# EAGLE schematic Lora_LR1262_Node_ Board_V1.0(1) (EAGLE 9.5.1)
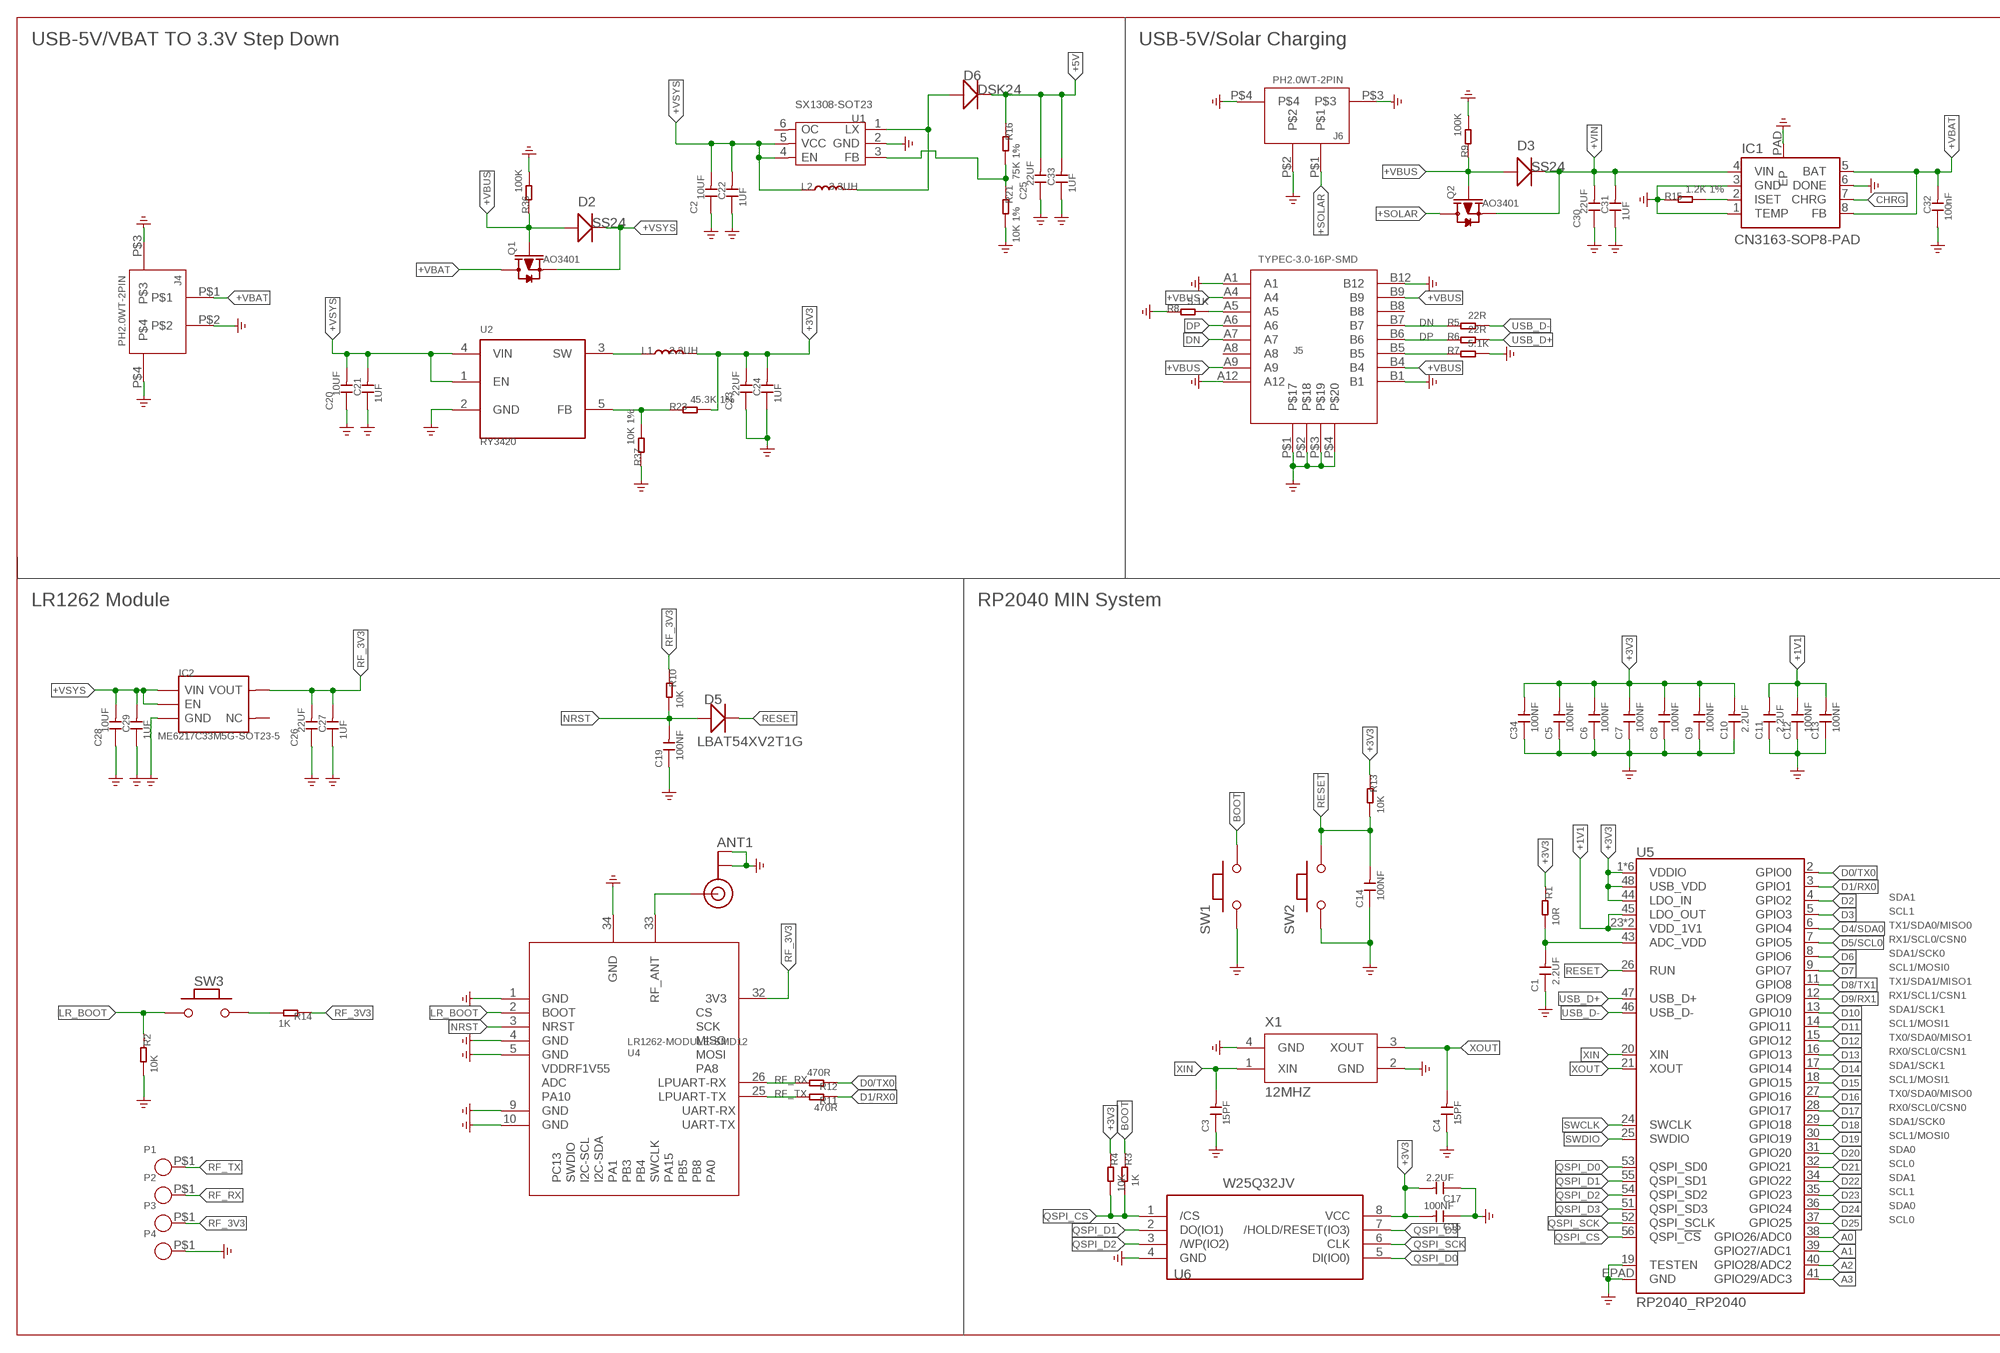
[diagram p0: schematic, sheet 1, part 1 of 2]
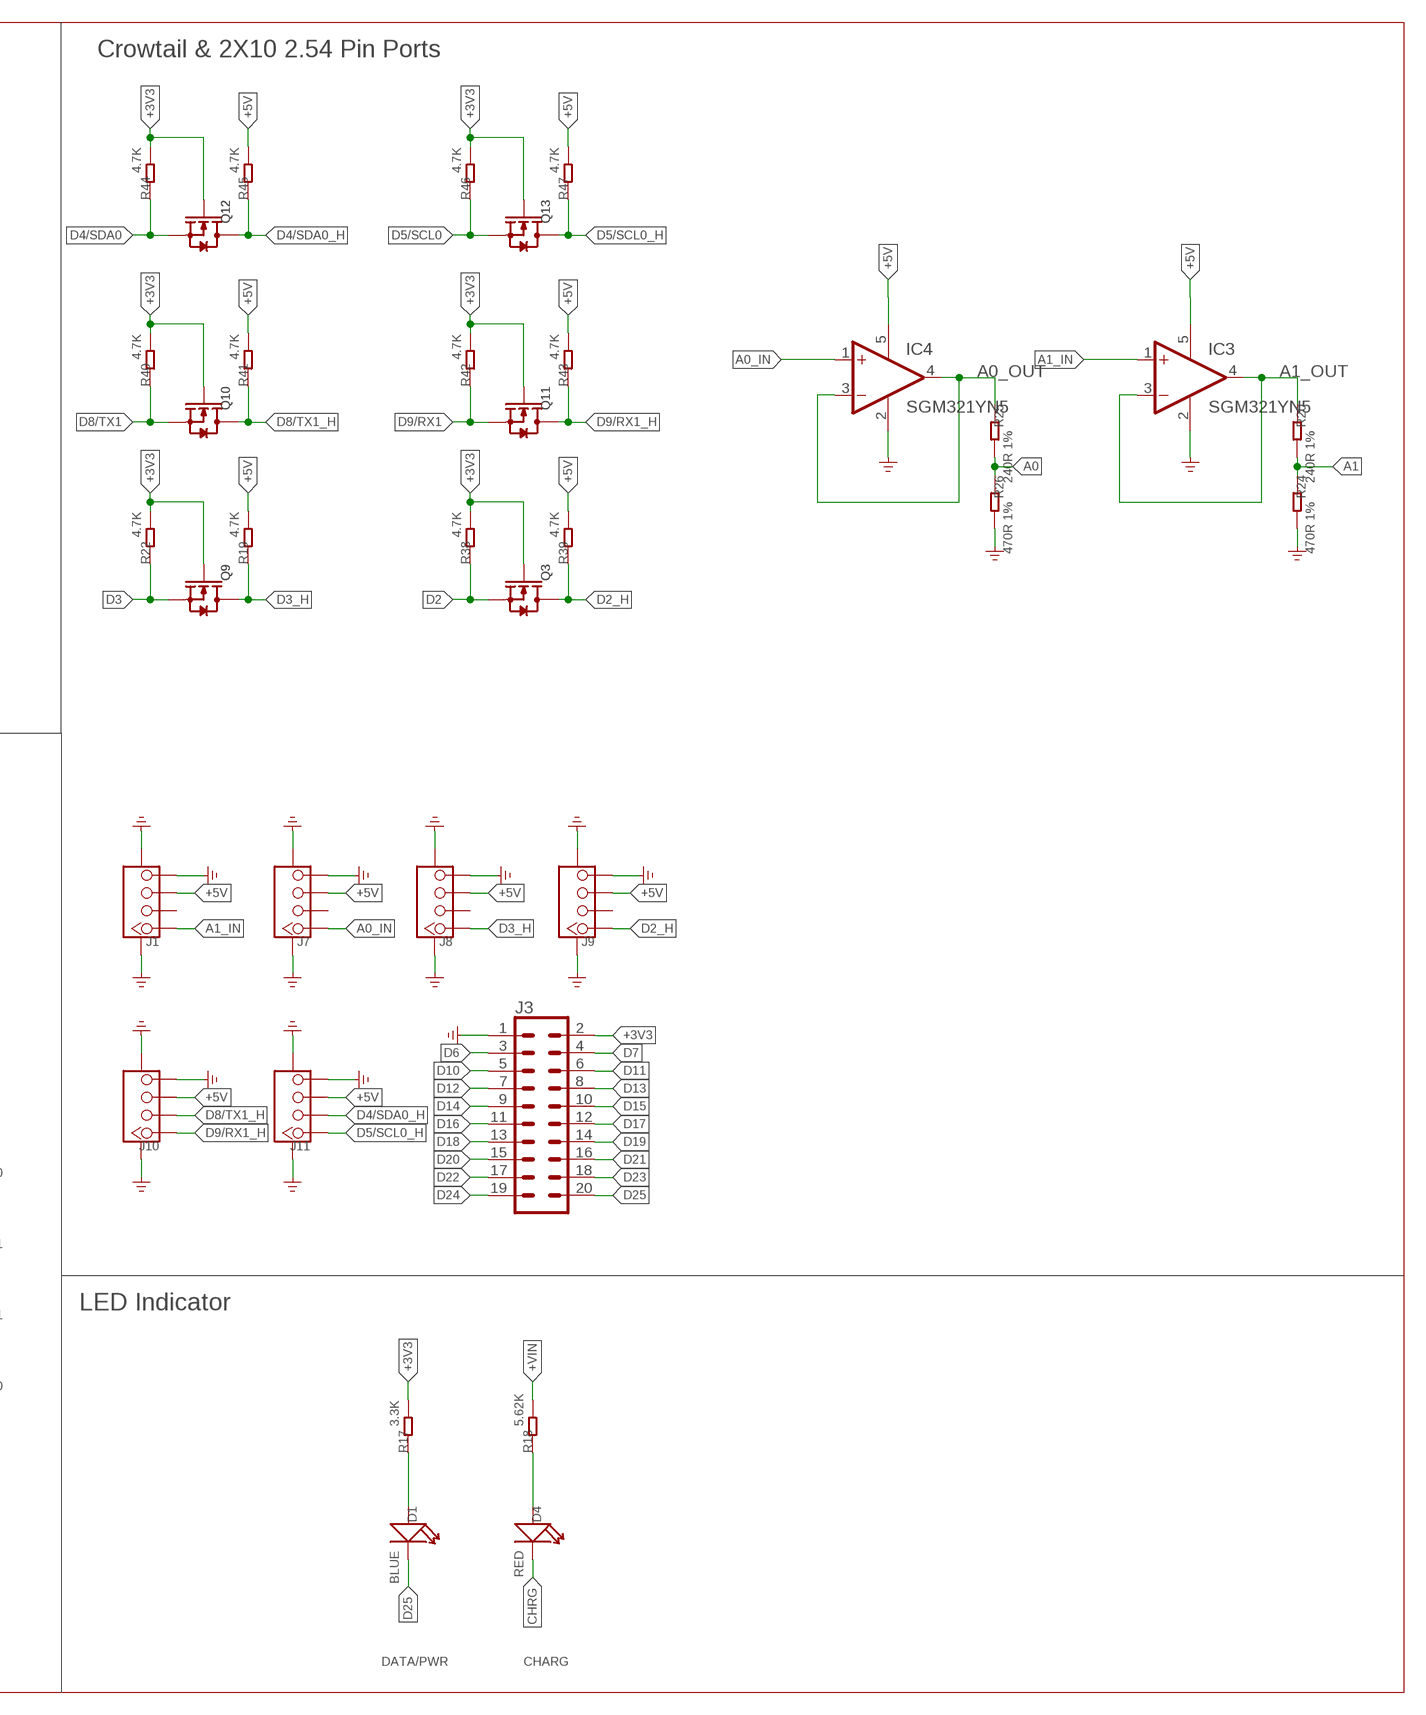
[diagram p1: schematic, sheet 1, part 2 of 2]

## Parts
ANT1  SPARKFUN2_U.FL  [SPARKFUN2_U.FL]
C1  2.2UF  CAPC0402-1  [0402]
C2  10UF  C0805  [C0805]
C3  15PF  CAPC0402-1  [0402]
C4  15PF  CAPC0402-1  [0402]
C5  100NF  CAPC0402-1  [0402]
C6  100NF  CAPC0402-1  [0402]
C7  100NF  CAPC0402-1  [0402]
C8  100NF  CAPC0402-1  [0402]
C9  100NF  CAPC0402-1  [0402]
C10  2.2UF  CAPC0402-1  [0402]
C11  2.2UF  CAPC0402-1  [0402]
C12  100NF  CAPC0402-1  [0402]
C13  100NF  CAPC0402-1  [0402]
C14  100NF  CAPC0402-1  [0402]
C15  100NF  CAPC0402-1  [0402]
C17  2.2UF  CAPC0402-1  [0402]
C19  100NF  CAPC0402-1  [0402]
C20  10UF  C0805  [C0805]
C21  1UF  C0603  [C0603]
C22  1UF  C0603  [C0603]
C23  22UF  C0805  [C0805]
C24  1UF  C0603  [C0603]
C25  22UF  C0805  [C0805]
C26  22UF  C0805  [C0805]
C27  1UF  C0603  [C0603]
C28  10UF  C0805  [C0805]
C29  1UF  C0603  [C0603]
C30  22UF  C0805  [C0805]
C31  1UF  C0603  [C0603]
C32  100nF  C0603  [C0603]
C33  1UF  C0603  [C0603]
C34  100NF  CAPC0402-1  [0402]
D1  BLUE  LED-SMT0603  [LED0603]
D2  SS24  DIODEB130L-13-F  [SMA]
D3  SS24  DIODEB130L-13-F  [SMA]
D4  RED  LED-SMT0603  [LED0603]
D5  LBAT54XV2T1G  DIODE0603  [D_SOD523]
D6  DSK24  DIODE  [D_SOD123FL]
IC1  CN3163-SOP8-PAD  [SOP8-PAD]
IC2  ME6217C33M5G-SOT23-5  [IC_SOT23-5]
IC3  SGM321YN5  LM321MF  [SOT23-5]
IC4  SGM321YN5  LM321MF  [SOT23-5]
J1  CONNECTOR_TWIG-4P-2.0-SMD-FEMALE-REINFORCE90D  [CONNECTOR_4P-SMD-2.0-90D]
J3  CONN_10X22X10-DSY-P2.54  [2X10-DSY-P2.54]
J4  PH2.0WT-2PIN  [PH2.0WT-2PIN]
J5  TYPEC-3.0-16P-SMD  [KEVIN_3.0TYPEC-SMD]
J6  PH2.0WT-2PIN  [PH2.0WT-2PIN]
J7  CONNECTOR_TWIG-4P-2.0-SMD-FEMALE-REINFORCE90D  [CONNECTOR_4P-SMD-2.0-90D]
J8  CONNECTOR_TWIG-4P-2.0-SMD-FEMALE-REINFORCE90D  [CONNECTOR_4P-SMD-2.0-90D]
J9  CONNECTOR_TWIG-4P-2.0-SMD-FEMALE-REINFORCE90D  [CONNECTOR_4P-SMD-2.0-90D]
J10  CONNECTOR_TWIG-4P-2.0-SMD-FEMALE-REINFORCE90D  [CONNECTOR_4P-SMD-2.0-90D]
J11  CONNECTOR_TWIG-4P-2.0-SMD-FEMALE-REINFORCE90D  [CONNECTOR_4P-SMD-2.0-90D]
L1  2.2UH  LL0420  [L0420]
L2  3.3UH  LL0420  [L0420]
P1  TEST_PADPAD-1.5MM  [TEST_PAD-1.5MM]
P2  TEST_PADPAD-1.5MM  [TEST_PAD-1.5MM]
P3  TEST_PADPAD-1.5MM  [TEST_PAD-1.5MM]
P4  TEST_PADPAD-1.5MM  [TEST_PAD-1.5MM]
Q1  AO3401  MOSFET-PSOT23  [PMOS_SOT23]
Q2  AO3401  MOSFET-PSOT23  [PMOS_SOT23]
Q3  MOSFET-NSI1304BDL  [MOS_SOT323]
Q9  MOSFET-NSI1304BDL  [MOS_SOT323]
Q10  MOSFET-NSI1304BDL  [MOS_SOT323]
Q11  MOSFET-NSI1304BDL  [MOS_SOT323]
Q12  MOSFET-NSI1304BDL  [MOS_SOT323]
Q13  MOSFET-NSI1304BDL  [MOS_SOT323]
R1  10R  RES-0402  [R0402]
R2  10K  RES-0402  [R0402]
R3  1K  RES-0402  [R0402]
R4  10K  RES-0402  [R0402]
R5  22R  RES-0402  [R0402]
R6  22R  RES-0402  [R0402]
R7  5.1K  RES-0402  [R0402]
R8  5.1K  RES-0402  [R0402]
R9  100K  RES-0402  [R0402]
R10  10K  RES-0402  [R0402]
R11  470R  RES-0402  [R0402]
R12  470R  RES-0402  [R0402]
R13  10K  RES-0402  [R0402]
R14  1K  RES-0402  [R0402]
R15  1.2K 1%  RES-0402  [R0402]
R16  75K 1%  RES-0402  [R0402]
R17  3.3K  RES-0402  [R0402]
R18  5.62K  RES-0402  [R0402]
R19  4.7K  RES-0402  [R0402]
R20  240R 1%  RES-0402  [R0402]
R21  10K 1%  RES-0402  [R0402]
R22  4.7K  RES-0402  [R0402]
R23  45.3K 1%  RES-0402  [R0402]
R24  470R 1%  RES-0402  [R0402]
R25  240R 1%  RES-0402  [R0402]
R26  470R 1%  RES-0402  [R0402]
R36  100K  RES-0402  [R0402]
R37  10K 1%  RES-0402  [R0402]
R38  4.7K  RES-0402  [R0402]
R39  4.7K  RES-0402  [R0402]
R40  4.7K  RES-0402  [R0402]
R41  4.7K  RES-0402  [R0402]
R42  4.7K  RES-0402  [R0402]
R43  4.7K  RES-0402  [R0402]
R44  4.7K  RES-0402  [R0402]
R45  4.7K  RES-0402  [R0402]
R46  4.7K  RES-0402  [R0402]
R47  4.7K  RES-0402  [R0402]
SW1  MYSMD_PB157_4.3X3  [MYSMD_157SW]
SW2  MYSMD_PB157_4.3X3  [MYSMD_157SW]
SW3  MYSMD_PB157_4.3X3  [MYSMD_157SW]
U1  SX1308-SOT23  STUDY_SX1301  [STUDY_SOT23-6L]
U2  RY3420  HM3416H  [IC_SOT23-5]
U4  LR1262-MODULE-SMD12  [LR1262-MODULE-SMD12]
U5  RP2040_RP2040  [RP2040_QFN-56]
U6  W25Q32JV  [SELF_SOIC-8-208MIL]
X1  12MHZ  XTAL-SMD3225  [SMD3225]

## Nets
+1V1: C11.2 C12.2 C13.2 U5.23(VDD_1V1) U5.45(LDO_OUT) U5.50(VDD_1V1)
+3V3: C5.2 C6.2 C7.2 C8.2 C9.2 C10.2 C15.2 C17.2 C23.2 C24.2 C34.2 J3.2 L1.2 Q3.1(G) Q9.1(G) Q10.1(G) Q11.1(G) Q12.1(G) Q13.1(G) R1.1 R4.1 R13.1 R17.2 R22.2 R23.2 R38.2 R40.2 R42.2 R44.2 R46.2 U5.1(VDDIO) U5.10(VDDIO) U5.22(VDDIO) U5.33(VDDIO) U5.42(VDDIO) U5.44(LDO_IN) U5.48(USB_VDD) U5.49(VDDIO) U6.8(VCC)
+5V: C25.2 C33.2 D6.- IC3.5(V+) IC4.5(V+) J1.3 J7.3 J8.3 J9.3 J10.3 J11.3 R16.1 R19.2 R39.2 R41.2 R43.2 R45.2 R47.2
+SOLAR: J6.P$1 Q2.3(D)
+VBAT: C32.2 IC1.5(BAT) IC1.8(FB) J4.P$1 Q1.3(D)
+VBUS: D2.2(+) D3.2(+) J5.A4 J5.A9 J5.B4 J5.B9 Q1.1(G) Q2.1(G) R9.1 R36.1
+VIN: C30.2 C31.2 D3.1(-) IC1.4(VIN) Q2.2(S) R18.2
+VSYS: C2.2 C20.2 C21.2 C22.2 C28.2 C29.2 D2.1(-) IC2.1(VIN) IC2.3(EN) L2.1 Q1.2(S) U1.4(EN) U1.5(VCC) U2.1(EN) U2.4(VIN)
A0: R25.2 R26.1 U5.38(GPIO26/ADC0)
A0_IN: IC4.1(+IN) J7.1
A0_OUT: IC4.3(-IN) IC4.4(OUT) R25.1
A1: R20.2 R24.1 U5.39(GPIO27/ADC1)
A1_IN: IC3.1(+IN) J1.1
A1_OUT: IC3.3(-IN) IC3.4(OUT) R20.1
A2: U5.40(GPIO28/ADC2)
A3: U5.41(GPIO29/ADC3)
BOOT: R3.1 SW1.2
CHRG: D4.- IC1.7(CHRG)
D0/TX0: R12.1 U5.2(GPIO0)
D1/RX0: R11.1 U5.3(GPIO1)
D2: Q3.2(S) R38.1 U5.4(GPIO2)
D2_H: J9.1 Q3.3(D) R39.1
D3: Q9.2(S) R22.1 U5.5(GPIO3)
D3_H: J8.1 Q9.3(D) R19.1
D4/SDA0: Q12.2(S) R44.1 U5.6(GPIO4)
D4/SDA0_H: J11.2 Q12.3(D) R45.1
D5/SCL0: Q13.2(S) R46.1 U5.7(GPIO5)
D5/SCL0_H: J11.1 Q13.3(D) R47.1
D6: J3.3 U5.8(GPIO6)
D7: J3.4 U5.9(GPIO7)
D8/TX1: Q10.2(S) R40.1 U5.11(GPIO8)
D8/TX1_H: J10.2 Q10.3(D) R41.1
D9/RX1: Q11.2(S) R42.1 U5.12(GPIO9)
D9/RX1_H: J10.1 Q11.3(D) R43.1
D10: J3.5 U5.13(GPIO10)
D11: J3.6 U5.14(GPIO11)
D12: J3.7 U5.15(GPIO12)
D13: J3.8 U5.16(GPIO13)
D14: J3.9 U5.17(GPIO14)
D15: J3.10 U5.18(GPIO15)
D16: J3.11 U5.27(GPIO16)
D17: J3.12 U5.28(GPIO17)
D18: J3.13 U5.29(GPIO18)
D19: J3.14 U5.30(GPIO19)
D20: J3.15 U5.31(GPIO20)
D21: J3.16 U5.32(GPIO21)
D22: J3.17 U5.34(GPIO22)
D23: J3.18 U5.35(GPIO23)
D24: J3.19 U5.36(GPIO24)
D25: D1.- J3.20 U5.37(GPIO25)
DN: J5.A7 J5.B7 R5.1
DP: J5.A6 J5.B6 R6.1
GND: ANT1.P$1(GND) ANT1.P$2(GND) C1.1 C2.1 C3.1 C4.1 C5.1 C6.1 C7.1 C8.1 C9.1 C10.1 C11.1 C12.1 C13.1 C14.1 C15.1 C17.1 C19.1 C20.1 C21.1 C22.1 C23.1 C24.1 C25.1 C26.1 C27.1 C28.1 C29.1 C30.1 C31.1 C32.1 C33.1 C34.1 IC1.1(TEMP) IC1.3(GND) IC1.6(DONE) IC1.PAD(EP) IC2.2(GND) IC3.2(V-) IC4.2(V-) J1.4 J1.SS1 J1.SS2 J3.1 J4.P$2 J4.P$3 J4.P$4 J5.A1 J5.A12 J5.B1 J5.B12 J5.P$1 J5.P$2 J5.P$3 J5.P$4 J6.P$2 J6.P$3 J6.P$4 J7.4 J7.SS1 J7.SS2 J8.4 J8.SS1 J8.SS2 J9.4 J9.SS1 J9.SS2 J10.4 J10.SS1 J10.SS2 J11.4 J11.SS1 J11.SS2 P4.P$1 R2.2 R7.2 R8.1 R9.2 R15.1 R21.2 R24.2 R26.2 R36.2 R37.1 SW1.1 SW2.1 U1.2(GND) U2.2(GND) U4.1(GND) U4.4(GND) U4.5(GND) U4.9(GND) U4.10(GND) U4.34(GND) U5.19(TESTEN) U5.EPAD(GND) U6.4(GND) X1.2(GND) X1.4(GND)
LR_BOOT: R2.1 SW3.1 U4.2(BOOT)
N$1: C1.2 R1.2 U5.43(ADC_VDD)
N$2: J5.B5 R7.1
N$3: L1.1 U2.3(SW)
N$4: D6.+ L2.2 U1.1(LX)
N$6: J5.A5 R8.2
N$7: R14.2 SW3.2
N$8: ANT1.P$3(SIGNAL) U4.33(RF_ANT)
N$9: R23.1 R37.2 U2.5(FB)
N$10: IC1.2(ISET) R15.2
N$11: D4.+ R18.1
N$13: R16.2 R21.1 U1.3(FB)
N$14: D1.+ R17.1
NRST: C19.2 D5.+ R10.2 U4.3(NRST)
QSPI_CS: R3.2 R4.2 U5.56(QSPI_!CS!) U6.1(/CS)
QSPI_D0: U5.53(QSPI_SD0) U6.5(DI(IO0))
QSPI_D1: U5.55(QSPI_SD1) U6.2(DO(IO1))
QSPI_D2: U5.54(QSPI_SD2) U6.3(/WP(IO2))
QSPI_D3: U5.51(QSPI_SD3) U6.7(/HOLD/RESET(IO3))
QSPI_SCK: U5.52(QSPI_SCLK) U6.6(CLK)
RESET: C14.2 D5.- R13.2 SW2.2 U5.26(RUN)
RF_3V3: C26.2 C27.2 IC2.5(VOUT) P3.P$1 R10.1 R14.1 U4.32(3V3)
RF_RX: P2.P$1 R12.2 U4.26(LPUART-RX)
RF_TX: P1.P$1 R11.2 U4.25(LPUART-TX)
SWCLK: U5.24(SWCLK)
SWDIO: U5.25(SWDIO)
USB_D+: R6.2 U5.47(USB_D+)
USB_D-: R5.2 U5.46(USB_D-)
XIN: C3.2 U5.20(XIN) X1.1(XIN)
XOUT: C4.2 U5.21(XOUT) X1.3(XOUT)
Unconnected: IC2.4(NC) J1.2 J5.A8 J5.B8 J7.2 J8.2 J9.2 U1.6(OC)

## Notes on the sheet
- USB-5V/VBAT TO 3.3V Step Down | USB-5V/Solar Charging | Crowtail & 2X10 2.54 Pin Ports
- LR1262 Module | RP2040 MIN System
- SDA1
- SCL1
- TX1/SDA0/MISO0
- RX1/SCL0/CSN0
- SDA1/SCK0
- SCL1/MOSI0
- TX1/SDA1/MISO1
- RX1/SCL1/CSN1
- SDA1/SCK1
- SCL1/MOSI1
- LED Indicator
- TX0/SDA0/MISO1
- RX0/SCL0/CSN1
- SDA1/SCK1
- SCL1/MOSI1
- TX0/SDA0/MISO0
- RX0/SCL0/CSN0
- SDA1/SCK0
- SCL1/MOSI0
- SDA0
- SCL0
- SDA1
- SCL1
- SDA0
- SCL0
- DATA/PWR | CHARG

## Library data of the parts
ANT1 = Lora_RA-08H_Node_ Board:SPARKFUN2_U.FL
C1 C3-C15 C17 C19 C34 = Lora_RA-08H_Node_ Board:CAP*
C2 C20 C23 C25 C26 C28 C30 = Lora_RA-08H_Node_ Board:C0805
C21 C22 C24 C27 C29 C31-C33 = Lora_RA-08H_Node_ Board:C0603
D1 D4 = Lora_RA-08H_Node_ Board:LED-SMT*
D2 D3 D5 D6 = Lora_RA-08H_Node_ Board:DIODE*
IC1 = Lora_RA-08H_Node_ Board:CN3163-SOP8-PAD
IC2 = Lora_RA-08H_Node_ Board:ME6217C33M5G-SOT23-5
IC3 IC4 = linear:LM321?*: Low Power Single Op Amp Source: http://cache.national.com/ds/LM/LM321.pdf
J1 J7-J11 = Lora_RA-08H_Node_ Board:CONNECTOR_TWIG-4P-2.0-SMD-FEMALE-REINFORCE
J3 = Lora_RA-08H_Node_ Board:CONN_10X2: Multi connection point. Often used as Generic Header-pin footprint for 0.1 inch spaced/style header connections On any of the 0.1 inch spaced packages, you can populate with these: Break Away Headers - Straight <https://www.sparkfun.com/products/116> (PRT-00116) Break Away Male Headers - Right Angle <https://www.sparkfun.com/products/553> (PRT-00553) Female Headers <https://www.sparkfun.com/products/115> (PRT-00115) Break Away Headers - Machine Pin <https://www.sparkfun.com/products/117> (PRT-00117) Break Away Female Headers - Swiss Machine Pin <https://www.sparkfun.com/products/743> (PRT-00743) Special note about the "SPECIAL" package: This was SPECIALLY designed to be used with our Graphic LCD Backpack. Be sure you want to use this! It is not only staggered on each line of header holes, but IT IS ALSO offset of the center point of the top and bottom lines by 5 mil. This causes the headers to lock into place on the "standard" footprint on the LCD screen. The extra squares on the tdocu layer are there simply to reference other pins (if you were to actually populate a longer header than ten long - this is what we do with the backpacks).
J4 J6 = Lora_RA-08H_Node_ Board:PH2.0WT-2PIN
J5 = Lora_RA-08H_Node_ Board:TYPEC-3.0-16P-SMD
L1 L2 = Lora_RA-08H_Node_ Board:L*
P1-P4 = Lora_RA-08H_Node_ Board:TEST_PAD*
Q1 Q2 = Lora_RA-08H_Node_ Board:MOSFET-P: IRLL014: http://www.vishay.com/docs/91319/sihll014.pdf
Q3 Q9-Q13 = Lora_RA-08H_Node_ Board:MOSFET-N*: IRLL014: http://www.vishay.com/docs/91319/sihll014.pdf
R1-R26 R36-R47 = Lora_RA-08H_Node_ Board:RES*
SW1-SW3 = Lora_RA-08H_Node_ Board:MYSMD_PB157_4.3X3
U1 = Crowtail- Air Quality Sensor  v1.0:STUDY_SX1301
U2 = Lora_RA-08H_Node_ Board:HM3416H
U4 = Lora_RA-08H_Node_ Board:LR1262-MODULE-SMD12
U5 = Lora_RA-08H_Node_ Board:RP2040_RP2040: Raspberry Pi RP2040 MCU 56-pin 32-bit Microcontroller with 264kB of SRAM and external flash support up to 16MB Getting Started with the RP2040 <https://pico.raspberrypi.org/getting-started/> Dual-core ARM Cortex M0+ processor, flexible clock running up to 133 MHz 264kB of SRAM, and QSPI control of common flash memory USB 1.1 Host and Device support Low-power sleep and dormant modes Drag & drop programming using mass storage over USB 26 multi-function GPIO pins 2×SPI, 2×I2C, 2×UART, 3×12-bit ADC, 16×controllable PWM channels Accurate clock and timer on-chip Temperature sensor Accelerated floating point libraries on-chip 8×Programmable IO (PIO) state machines for custom peripheral support; PROD_ID: IC-15502
U6 = Lora_RA-08H_Node_ Board:W25Q32JV
X1 = Lora_RA-08H_Node_ Board:XTAL-SMD3225